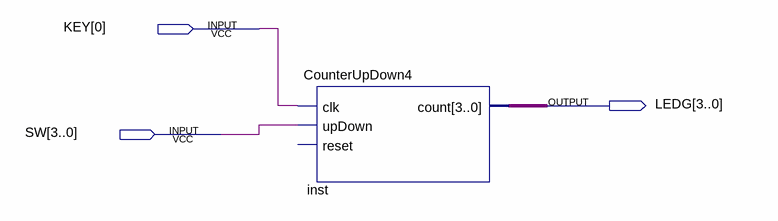
[diagram p0: schematic sheet]
// Quartus schematic Counter_Demo.bdf as structural Verilog: 1 symbols, 3 pins
module Counter_Demo (
  input  [0:0] KEY,
  input  [3:0] SW,
  output [3:0] LEDG
);

  wire undriven;

  CounterUpDown4 inst (.clk(KEY[0]), .upDown(undriven), .count(LEDG));  // open: reset
endmodule
